# EAGLE design RaspiPower (EAGLE 7.7.0)
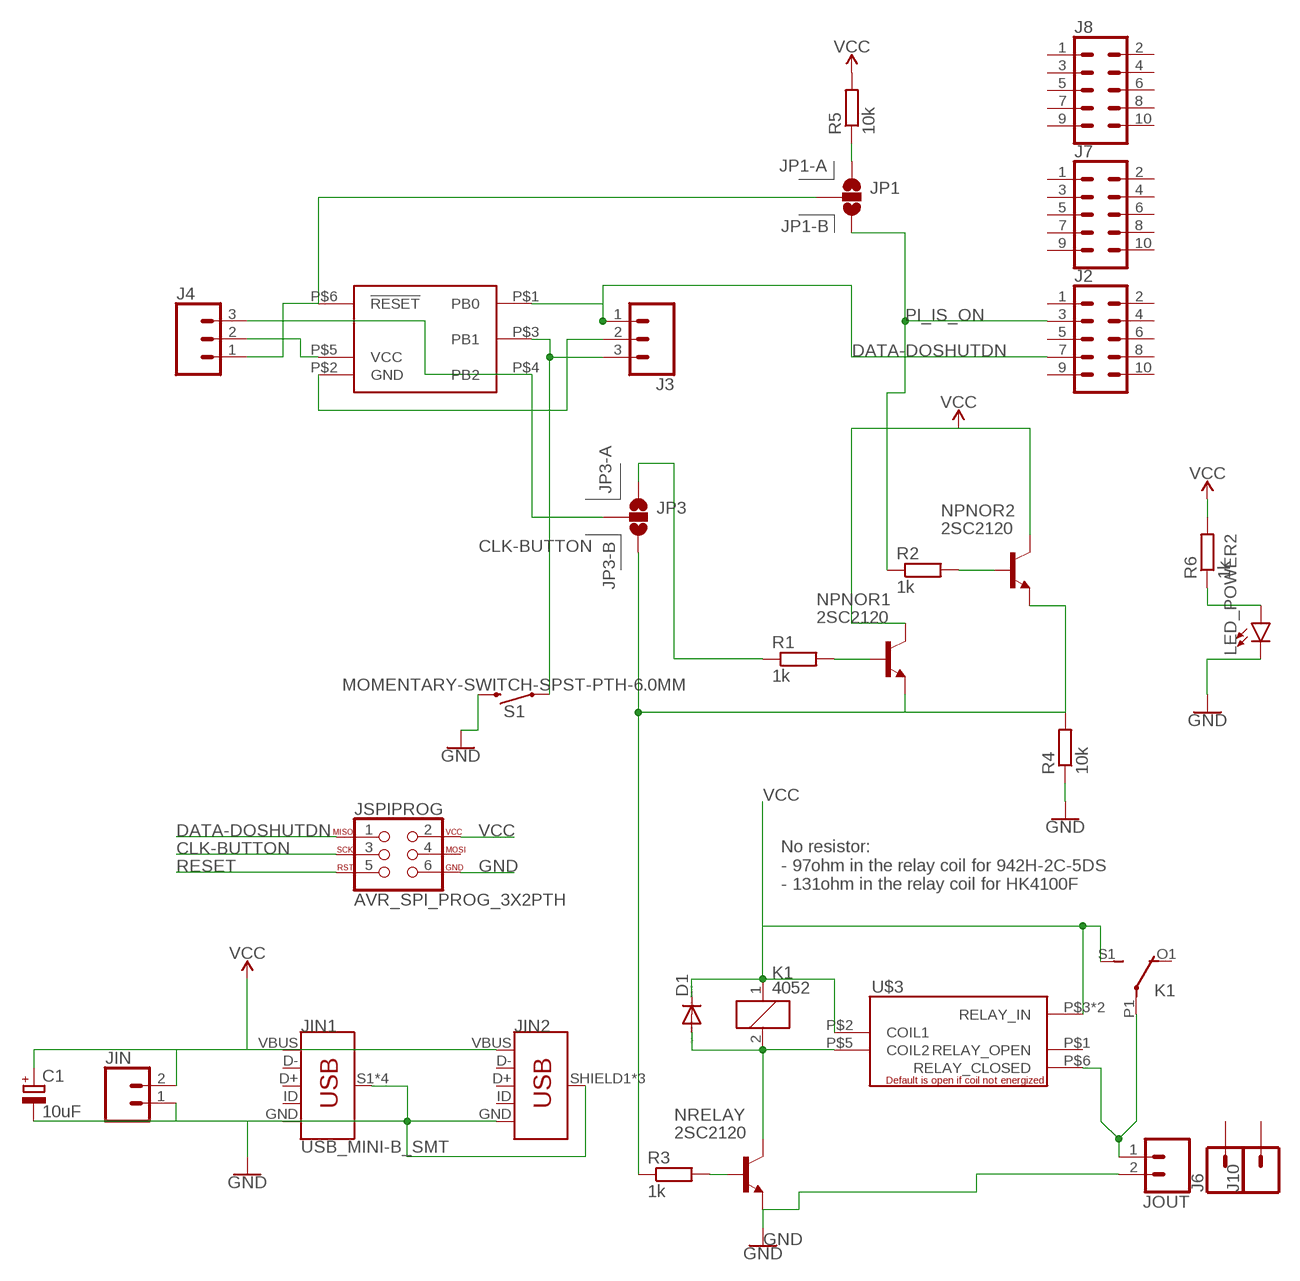
[diagram p0: schematic, sheet 1]

## Parts
C1  10uF  CPOL-EUE2.5-5  [E2,5-5]
D1  DIODE-D-5  [D-5]
J2  CONN_05X2PTH  [2X5]
J3  CONN_03  [1X03]
J4  CONN_03  [1X03]
J6  CONN_01PTH_NO_SILK_YES_STOP  [1X01_NO_SILK]
J7  CONN_05X2PTH  [2X5]
J8  CONN_05X2PTH  [2X5]
J10  CONN_01PTH_NO_SILK_YES_STOP  [1X01_NO_SILK]
JIN  CONN_02LOCK_LONGPADS  [1X02_LOCK_LONGPADS]
JIN1  USB_MINI-B_SMT  [USB-MINIB]
JIN2  USB_MICRO-B_FEMALE-SMT  [USB-B-MICRO-SMD]
JOUT  CONN_02LOCK_LONGPADS  [1X02_LOCK_LONGPADS]
JP1  JUMPER-SMT_3_NO_SILK  [SMT-JUMPER_3_NO_SILK]
JP3  JUMPER-SMT_3_NO_SILK  [SMT-JUMPER_3_NO_SILK]
JSPIPROG  AVR_SPI_PROG_3X2PTH  [2X3]
K1  4052  [F4052]
LED_POWER2  LED-FKIT-1206  [FKIT-LED-1206]
NPNOR1  2SC2120  -NPN-TO92-ECB  [TO92-ECB]
NPNOR2  2SC2120  -NPN-TO92-ECB  [TO92-ECB]
NRELAY  2SC2120  -NPN-TO92-ECB  [TO92-ECB]
R1  1k  R-EU_0207/2V  [0207/2V]
R2  1k  R-EU_0207/2V  [0207/2V]
R3  1k  R-EU_0204/7  [0204/7]
R4  10k  R-EU_0207/2V  [0207/2V]
R5  10k  R-EU_0207/2V  [0207/2V]
R6  1k  R-EU_R1206W  [R1206W]
S1  MOMENTARY-SWITCH-SPST-PTH-6.0MM  [TACTILE_SWITCH_PTH_6.0MM]
U$1  ATTINY10  [SOT23]
U$3  HK4100F  [HK4100F]

## Nets
CLK-BUTTON: J3.3 JSPIPROG.3 S1.1 U$1.P$3(PB1)
DATA-DOSHUTDN: J2.7 J3.1 JSPIPROG.1 U$1.P$1(PB0)
GND: C1.- J3.2 JIN1.GND JIN1.S1(SHIELD) JIN1.S2(SHIELD) JIN1.S3(SHIELD) JIN1.S4(SHIELD) JIN2.GND JIN2.SHIELD1(SHIELD) JIN2.SHIELD2(SHIELD) JIN2.SHIELD3(SHIELD) JIN.1 JOUT.2 JSPIPROG.6 LED_POWER2.C NRELAY.E R4.1 S1.3 U$1.P$2(GND)
N$1: LED_POWER2.A R6.1
N$4: JP3.3 NPNOR1.E NPNOR2.E R3.1 R4.2
N$5: J4.3 JP3.2 U$1.P$4(PB2)
N$7: JP1.1 R5.1
N$8: NRELAY.B R3.2
N$9: D1.A K1.2 NRELAY.C U$3.P$5(COIL2)
N$11: NPNOR1.B R1.2
N$12: NPNOR2.B R2.2
N$14: JP3.1 R1.1
PI_IS_ON: J2.3 JP1.3 R2.1
RESET: J4.1 JP1.2 JSPIPROG.5 U$1.P$6(!RESET)
VCC: C1.+ D1.C J4.2 JIN1.VBUS JIN2.VBUS JIN.2 JSPIPROG.2 K1.1 K1.S1(2:S) NPNOR1.C NPNOR2.C R5.2 R6.2 U$1.P$5(VCC) U$3.P$2(COIL1) U$3.P$3(RELAY_IN) U$3.P$4(RELAY_IN)
VOUT: JOUT.1 K1.P1(2:P) U$3.P$6(RELAY_CLOSED)
Unconnected: J2.1 J2.2 J2.4 J2.5 J2.6 J2.8 J2.9 J2.10 J6.1 J7.1 J7.2 J7.3 J7.4 J7.5 J7.6 J7.7 J7.8 J7.9 J7.10 J8.1 J8.2 J8.3 J8.4 J8.5 J8.6 J8.7 J8.8 J8.9 J8.10 J10.1 JIN1.D+ JIN1.D- JIN1.ID JIN2.D+ JIN2.D- JIN2.ID JSPIPROG.4 K1.O1(2:O) K1.O2(3:O) K1.P2(3:P) K1.S2(3:S) U$3.P$1(RELAY_OPEN)

## Notes on the sheet
- JP1-A
- JP1-B
- JP3-A
- JP3-B
- No resistor: 
  - 97ohm in the relay coil for 942H-2C-5DS
  - 131ohm in the relay coil for HK4100F

## Library data of the parts
C1 = resistor:CPOL-EU: POLARIZED CAPACITOR, European symbol
D1 = diode:DIODE-: DIODE
J2 J7 J8 = SparkFun-Connectors:CONN_05X2: Multi connection point. Often used as Generic Header-pin footprint for 0.1 inch spaced/style header connections For AVR SPI programming port, see special device with nice symbol: "AVR_SPI_PROG_5x2.dev" You can populate with any combo of single row headers, but if you'd like an exact match, check these: 2x5 AVR ICSP Male Header <https://www.sparkfun.com/products/778> (PRT-00778) 2x5 Pin Shrouded Header <https://www.sparkfun.com/products/8506> (PRT-08506) On any of the 0.1 inch spaced packages, you can populate with these: Break Away Headers - Straight <https://www.sparkfun.com/products/116> (PRT-00116) Break Away Male Headers - Right Angle <https://www.sparkfun.com/products/553> (PRT-00553) Female Headers <https://www.sparkfun.com/products/115> (PRT-00115) Break Away Headers - Machine Pin <https://www.sparkfun.com/products/117> (PRT-00117) Break Away Female Headers - Swiss Machine Pin <https://www.sparkfun.com/products/743> (PRT-00743) Special note: the shrouded connector mates well with our 5x2 ribbon cables: 2x5 Pin IDC Ribbon Cable <https://www.sparkfun.com/products/8535> (PRT-08535); PROD_ID: CONN-08499; SF_ID: PRT-0778
J3 J4 = SparkFun-Connectors:CONN_03: Multi connection point. Often used as Generic Header-pin footprint for 0.1 inch spaced/style header connections On any of the 0.1 inch spaced packages, you can populate with these: Break Away Headers - Straight <https://www.sparkfun.com/products/116> (PRT-00116) Break Away Male Headers - Right Angle <https://www.sparkfun.com/products/553> (PRT-00553) Female Headers <https://www.sparkfun.com/products/115> (PRT-00115) Break Away Headers - Machine Pin <https://www.sparkfun.com/products/117> (PRT-00117) Break Away Female Headers - Swiss Machine Pin <https://www.sparkfun.com/products/743> (PRT-00743) Stackable Header - 3 Pin (Female, 0.1") <https://www.sparkfun.com/products/13875> (PRT-13875) For SCREWTERMINALS and SPRING TERMINALS visit here: Screw Terimnals on SparkFun.com <https://www.sparkfun.com/search/results?term=Screw+Terminals> (5mm/3.5mm/2.54mm spacing) This device is also useful as a general connection point to wire up your design to another part of your project. Our various solder wires solder well into these plated through hole pads. Hook-Up Wire - Assortment (Stranded, 22 AWG) <https://www.sparkfun.com/products/11375> (PRT-11375) Hook-Up Wire - Assortment (Solid Core, 22 AWG) <https://www.sparkfun.com/products/11367> (PRT-11367) View the entire wire category on our website here <https://www.sparkfun.com/categories/141> Special notes: Molex polarized connector foot print use with SKU : PRT-08232 with associated crimp pins and housings.; PROD_ID: XXX-00000; VALUE: 455-1750-1-ND
J6 J10 = SparkFun-Connectors:CONN_01: Single connection point. Often used as Generic Header-pin footprint for 0.1 inch spaced/style header connections On any of the 0.1 inch spaced packages, you can populate with these: Break Away Headers - Straight <https://www.sparkfun.com/products/116> (PRT-00116) Break Away Male Headers - Right Angle <https://www.sparkfun.com/products/553> (PRT-00553) Female Headers <https://www.sparkfun.com/products/115> (PRT-00115) Break Away Headers - Machine Pin <https://www.sparkfun.com/products/117> (PRT-00117) Break Away Female Headers - Swiss Machine Pin <https://www.sparkfun.com/products/743> (PRT-00743) This device is also useful as a general connection point to wire up your design to another part of your project. Our various solder wires solder well into these plated through hole pads. Hook-Up Wire - Assortment (Stranded, 22 AWG) <https://www.sparkfun.com/products/11375> (PRT-11375) Hook-Up Wire - Assortment (Solid Core, 22 AWG) <https://www.sparkfun.com/products/11367> (PRT-11367) View the entire wire category on our website here <https://www.sparkfun.com/categories/141> Special notes: SMTSO-256-ET is a "flush mount" nut for a 4-40 screw. We mostly use this on specialty testbeds; it is a nice way to connect hardware to your PCB at an adjustable hieght. Also note, the SNAP packages are for using a snappable style connector. We sell a baggie of snaps and they are also used on two LilyPad designs: Snap Assortment - 30 pack (male and female) <https://www.sparkfun.com/products/11347> (DEV-11347) LilyPad Arduino SimpleSnap <https://www.sparkfun.com/products/10941> (DEV-10941) LilyPad SimpleSnap Protoboard <https://www.sparkfun.com/products/10940> (DEV-10940)
JIN JOUT = SparkFun-Connectors:CONN_02: Multi connection point. Often used as Generic Header-pin footprint for 0.1 inch spaced/style header connections On any of the 0.1 inch spaced packages, you can populate with these: Break Away Headers - Straight <https://www.sparkfun.com/products/116> (PRT-00116) Break Away Male Headers - Right Angle <https://www.sparkfun.com/products/553> (PRT-00553) Female Headers <https://www.sparkfun.com/products/115> (PRT-00115) Break Away Headers - Machine Pin <https://www.sparkfun.com/products/117> (PRT-00117) Break Away Female Headers - Swiss Machine Pin <https://www.sparkfun.com/products/743> (PRT-00743) For SCREWTERMINALS and SPRING TERMINALS visit here: Screw Terimnals on SparkFun.com <https://www.sparkfun.com/search/results?term=Screw+Terminals> (5mm/3.5mm/2.54mm spacing) This device is also useful as a general connection point to wire up your design to another part of your project. Our various solder wires solder well into these plated through hole pads. Hook-Up Wire - Assortment (Stranded, 22 AWG) <https://www.sparkfun.com/products/11375> (PRT-11375) Hook-Up Wire - Assortment (Solid Core, 22 AWG) <https://www.sparkfun.com/products/11367> (PRT-11367) View the entire wire category on our website here <https://www.sparkfun.com/categories/141> Special notes: Molex polarized connector foot print use with: PRT-08233 with associated crimp pins and housings. 2.54_SCREWTERM for use with PRT-10571. 3.5mm Screw Terminal footprints for PRT-08084 5mm Screw Terminal footprints for use with PRT-08432
JIN1 = SparkFun-Connectors:USB_MINI-B: USB type Mini-B Connector Breaks out 5th pin, and includes shield pins if needed. SparkFun Products: SparkFun FTDI Basic Breakout <https://www.sparkfun.com/products/9716> SparkFun XBee Explorer USB <https://www.sparkfun.com/products/11812> SparkFun Redboard <https://www.sparkfun.com/products/12757>; PROD_ID: CONN-08193; SF_ID: PRT-00587
JIN2 = SparkFun-Connectors:USB_MICRO-B: USB Type Micro-B Connector Male/female and PTH/SMT variants SparkFun Products: SparkFun microB USB Breakout <https://www.sparkfun.com/products/12035> SparkFun USB microB Plug Breakout <https://www.sparkfun.com/products/10031> SparkFun ESP8266 Thing <https://www.sparkfun.com/products/13231>; PROD_ID: CONN-11752
JP1 JP3 = SparkFun-Jumpers:JUMPER-SMT_3_NO: Normally open jumper This jumper has three pads in close proximity to each other. Apply solder to close the connection(s).
JSPIPROG = SparkFun-Connectors:AVR_SPI_PROG_3X2: AVR ISP 6 Pin This is the reduced ISP connector for AVR programming. Common on Arduino. This footprint will take up less PCB space and can be used with a 10-pin to 6-pin adapter such as SKU: BOB-08508 **Special note about "TEST_POINT" package. The stop mask is on the top side, so if you want your programming test points to be on the bottom of your board, make sure to place this package on the bottom side of the board. This also ensure that the orientation to program from the bottom side will be correct. SparkFun Products: SparkFun ISP Pogo Adapter <https://www.sparkfun.com/products/11591> - NS Tiny AVR Programmer <https://www.sparkfun.com/products/11801> -PTH
K1 = relay:4052: RELAY 2 x switch, Finder; OC_FARNELL: unknown; OC_NEWARK: unknown
LED_POWER2 = SparkFun-LED:LED: LED (Generic) Standard schematic elements and footprints for 5mm, 3mm, 1206, and 0603 sized LEDs. Generic LEDs with no color specified.
NPNOR1 NPNOR2 NRELAY = transistor:*-NPN-: NPN Transistror BF959 corrected 2008.03.06
R1-R6 = resistor:R-EU_: RESISTOR, European symbol
S1 = SparkFun-Switches:MOMENTARY-SWITCH-SPST: Momentary Switch (Pushbutton) - SPST Normally-open (NO) SPST momentary switches (buttons, pushbuttons). Variants PTH-12MM - 12mm square, through-hole Momentary Pushbutton Switch - 12mm Square <https://www.sparkfun.com/products/9190> (COM-09190) PTH-6.0MM, PTH-6.0MM-KIT - 6.0mm square, through-hole Mini Pushbutton Switch <https://www.sparkfun.com/products/97> (COM-00097) KIT package intended for soldering kit's - only one side of pads' copper is exposed. PTH-RIGHT-ANGLE-KIT - Right-angle, through-hole Right Angle Tactile Button <https://www.sparkfun.com/products/10791> - Used on SparkFun BigTime Watch Kit <https://www.sparkfun.com/products/11734> SMD-12MM - 12mm square, surface-mount Tactile Button - SMD (12mm) <https://www.sparkfun.com/products/12993> (COM-12993) Used on SparkFun PicoBoard <https://www.sparkfun.com/products/11888> SMD-4.5MM - 4.5mm Square Trackball Switch Used on SparkFun Blackberry Trackballer Breakout <https://www.sparkfun.com/products/13169> SMD-4.6MMX2.8MM - 4.60mm x 2.80mm, surface mount Used on SparkFun SAMD21 Mini Breakout <https://www.sparkfun.com/products/13664> SMD-5.2MM, SMD-5.2-REDUNDANT - 5.2mm square, surface-mount Mini Pushbutton Switch - SMD <https://www.sparkfun.com/products/8720> (COM-08720) Used on Arduino Pro Mini <https://www.sparkfun.com/products/11114> REDUNDANT package connects both switch circuits together SMD-6.0X3.5MM - 6.0 x 3.5mm, surface mount Momentary Reset Switch SMD <https://www.sparkfun.com/products/8229> (COM-08229) SMD-6.2MM-TALL - 6.2mm square, surface mount Tactile Button - SMD (6mm) <https://www.sparkfun.com/products/12992> Used on SparkFun Digital Sandbox <https://www.sparkfun.com/products/12651> SMD-RIGHT-ANGLE - Right-angle, surface mount Used on SparkFun Block for Intel® Edison - Arduino <https://www.sparkfun.com/products/13036>; PROD_ID: SWCH-08441; SF_SKU: COM-00097
U$1 = kalshagar:ATTINY10
U$3 = kalshagar:HK4100F: HK4100F-DC5V-SHG 5v relay

## Board
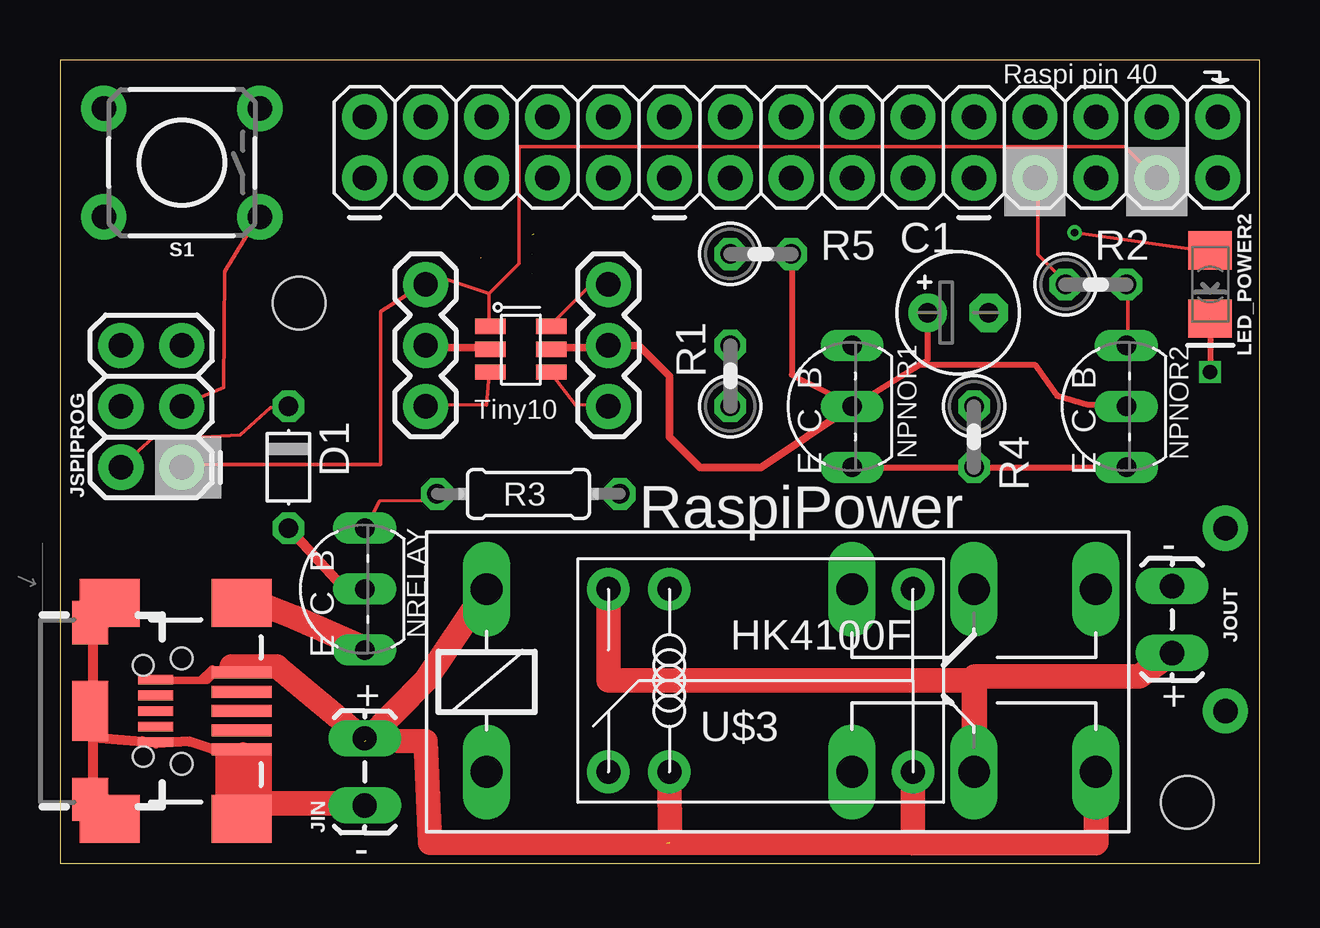
[diagram p1: board, top side]
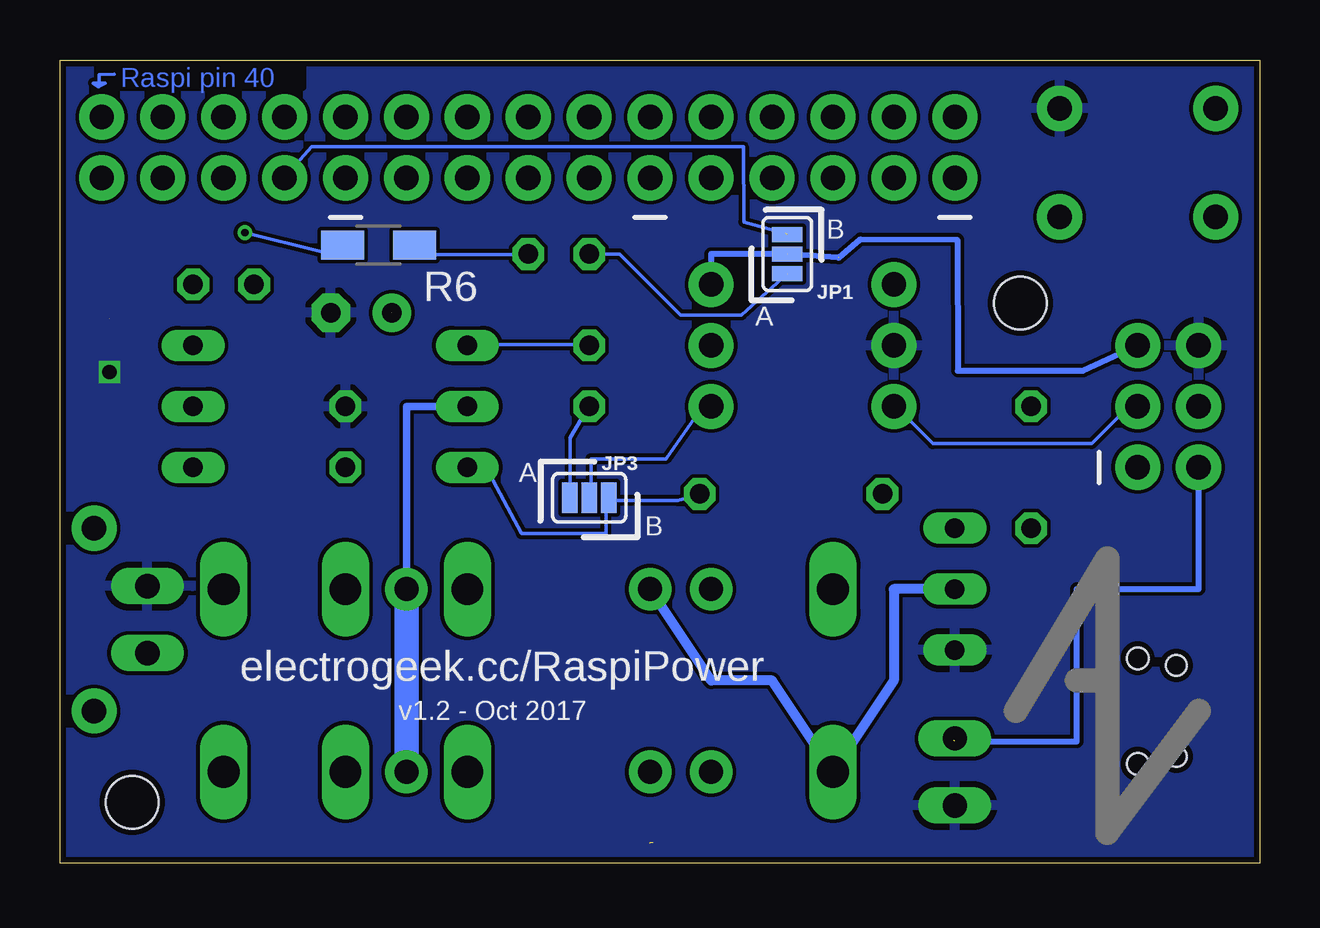
[diagram p2: board, bottom side, seen from below]

Size 50 x 33.49 mm. Coordinates in mm from the lower left corner, seen from the top.
Outline: 0,0 50,0 50,33.49 0,33.49 0,0
Copper layers (1*16): Top 0.035mm / dielectric 1.5mm / Bottom 0.035mm
Design rules "SeeedStudio_2layer_DRU_no_angle_20140221": minimum track width 6mil, minimum drill 12mil, track to track 6mil, track to pad 6mil, pad to pad 6mil, via to via 6mil, smd to smd 0mil, copper to edge 10mil, drill to drill 10mil, minimum pad ring 10mil, minimum via ring 6mil, stop-mask expansion 2mil, vias tented up to drill 100mil, thermal gap 10mil
Holes 2.2 mm at 9.97,23.35 46.99,2.54

### Footprints (pad centres in the part's own frame; a part is rotated, then mirrored left to right if it is on the bottom)
E2,5-5 = drill 0.813 pad 1.6: + -1.27,0 | drill 0.813 pad 1.6 octagon: - 1.27,0
D-5 = drill 0.813 octagon: A 2.54,0; C -2.54,0
2X5 = drill 1.016 pad 1.88: 1 0,0; 2 0,2.54; 3 2.54,0; 4 2.54,2.54; 5 5.08,0; 6 5.08,2.54; 7 7.62,0; 8 7.62,2.54; 9 10.16,0; 10 10.16,2.54
1X03 = drill 1.016 pad 1.88: 1 0,0; 2 2.54,0; 3 5.08,0
1X01_NO_SILK = drill 1.016 pad 1.88: 1 0,0
1X02_LOCK_LONGPADS = drill 1.016 long: 1 -0.127,0; 2 2.667,0
USB-MINIB = smd 2.5 x 0.5: D+ 2.5,0; D- 2.5,0.8; GND 2.5,-1.6; ID 2.5,-0.8; VBUS 2.5,1.6 | smd 2.5 x 2: S1 -3,4.5; S2 2.5,4.5; S3 -3,-4.5; S4 2.5,-4.5 | hole 0.9: 0,2.2; 0,-2.2
USB-B-MICRO-SMD = smd 1.45 x 0.4: D+ 2.725,0; D- 2.725,0.65; GND 2.725,-1.3; ID 2.725,-0.65; VBUS 2.725,1.3 | smd 1.5 x 1.8: SHIELD1 0,3.685; SHIELD2 0,-3.685 | smd 1.5 x 2.5: SHIELD3 0,0 | hole 0.85: 2.2,1.9; 2.2,-1.9
SMT-JUMPER_3_NO_SILK = smd 0.635 x 1.27: 1 -0.813,0; 2 0,0; 3 0.813,0
2X3 = drill 1.016 pad 1.88: 1 0,0; 2 0,2.54; 3 2.54,0; 4 2.54,2.54; 5 5.08,0; 6 5.08,2.54
F4052 = drill 1.321 long: 1 -3.81,3.81; 2 -3.81,-3.81; O1 11.43,-3.81; O2 11.43,3.81; P1 16.51,-3.81; P2 16.51,3.81; S1 21.59,-3.81; S2 21.59,3.81
FKIT-LED-1206 = smd 1.6 x 1.803: A -1.422,0; C 1.422,0
TO92-ECB = drill 0.813 long: B 2.54,0; C 0,0; E -2.54,0
0207/2V = drill 0.813 octagon: 1 -1.27,0; 2 1.27,0
0204/7 = drill 0.813 octagon: 1 -3.81,0; 2 3.81,0
R1206W = smd 1.8 x 1.2: 1 -1.499,0; 2 1.499,0
TACTILE_SWITCH_PTH_6.0MM = drill 1.016 pad 1.88: 1 -3.251,2.261; 2 3.251,2.261; 3 -3.251,-2.261; 4 3.251,-2.261
SOT23 = smd 0.635 x 1.27: P$1 0.476,-0.476; P$2 1.429,-0.476; P$3 2.381,-0.476; P$4 2.381,2.064; P$5 1.429,2.064; P$6 0.476,2.064
HK4100F = drill 1 pad 1.778: P$1 -3.81,-2.54; P$2 -1.27,-2.54; P$3 8.89,-2.54; P$4 8.89,5.08; P$5 -1.27,5.08; P$6 -3.81,5.08

### Placement (x,y rotation side)
C1  37.44,22.95 0 top
D1  9.53,16.51 270 top
J2  38.1,28.57 0 top
J3  15.24,24.13 270 top
J4  22.86,24.13 270 top
J6  48.58,6.35 0 top
J7  25.4,28.57 0 top
J8  12.7,28.57 0 top
J10  48.58,13.97 0 top
JIN  12.7,2.54 90 top
JIN1  5.08,6.35 0 top
JIN2  1.27,6.35 0 top
JOUT  46.35,8.89 90 top
JP1  19.68,25.4 90 bottom
JP3  27.94,15.24 0 bottom
JSPIPROG  5.08,16.51 90 top
K1  21.59,7.62 0 top
LED_POWER2  47.94,24.13 270 top
NPNOR1  33.02,19.05 90 top
NPNOR2  44.45,19.05 90 top
NRELAY  12.7,11.43 90 top
R1  27.94,20.32 90 top
R2  43.18,24.13 0 top
R3  19.53,15.4 180 top
R4  38.1,17.78 270 top
R5  29.21,25.4 0 top
R6  36.72,25.77 0 bottom
S1  5.08,29.21 180 top
U$1  18.41,22.86 270 top
U$3  26.67,6.35 0 top

### Tracks (layer width: path | path; a pad name or v marks a point on that pad's centre or on a via)
CLK-BUTTON
  Top 0.152: U$1.P$3 17.88,20.38 17.79,19.11 15.25,19.12 J3.3 | JSPIPROG.3 5.12,19.12 6.83,19.84 6.86,24.66 8.12,26.75 8.25,26.88 S1.1
  Bottom 0.152: J3.3 15.12,19 13.62,17.5 7,17.5 5.5,19 5.12,19 JSPIPROG.3
DATA-DOSHUTDN
  Top 0.152: 17.89,23.76 16,24.38 15.25,24.38 15.25,24.25 J3.1 15.12,24.12 13.37,23 13.37,16.62 5.12,16.62 JSPIPROG.1 | 17.89,23.76 17.88,22.5 U$1.P$1 | 17.89,23.76 19.12,25 19.12,29.88 44.38,29.88 45.62,28.62 J2.7
GND  (via drill 0.6)  (1 unrouted)
  Top 0.152: 7.5,4.68 7.5,4.75 JIN1.GND 7.62,4.75 | 4,5 JIN2.GND 3.88,5.12 3.43,5.09 | JIN1.S1 2,10.75 1.38,10.12 JIN2.SHIELD1 1.38,10 | JIN1.S3 2,1.88 2,2 1.38,2.62 JIN2.SHIELD2 1.38,2.75 | JIN2.SHIELD3 1.38,6.25 1.38,5.25 JIN2.SHIELD3 | 1.38,6.38 JIN2.SHIELD3 | 17.88,21.5 U$1.P$2 | 15.25,21.5 J3.2 | 47.88,22.62 LED_POWER2.C | 46.38,11.62 JOUT.2 | 7.62,10.75 JIN1.S2 | 12.62,9 NRELAY.E | 12.62,2.5 JIN.1 | 7.62,2.5 7.62,1.88 JIN1.S4 7.62,2.5
  Top 0.254: LED_POWER2.C v47.94,20.48
  Top 0.305: 15.25,21.5 17.88,21.5
  Top 0.406: 7.5,4.68 6.35,4.76 5.4,5.08 4,5 | 1.38,2.75 1.38,5.25 3.43,5.09 | 1.38,6.38 1.38,10 | 8.52,10.75 7.62,10.75
  Top 0.61: 7.62,4.75 7.62,2.5
  Top 1.016: 8.52,10.75 9.79,10.25 12.62,9 | 12.62,2.5 7.62,2.5
  pour Bottom: -1.27,34.29 50.8,34.29 50.8,-1.27 -1.27,-1.27
N$1  (via drill 0.3)
  Top 0.152: v42.29,26.29 47.88,25.5 LED_POWER2.A
  Bottom 0.152: v42.29,26.29 39.12,25.5 38.68,25.82 R6.1
N$2
  Bottom 0.152: 47.74,32.89 48.36,32.88 48.36,32.39 48.11,32.53 48.61,32.52 48.38,32.38
N$4
  Top 0.254: NPNOR1.E R4.2 NPNOR2.E
  Bottom 0.152: R3.1 24.25,15.12 27.12,15.12 JP3.3 27.25,15.12 27.25,13.75 30.77,13.75 32.25,16.5 33,16.5 NPNOR1.E
N$5
  Top 0.152: U$1.P$4 20.5,20.38 21.48,19.11 22.75,19.12 J4.3
  Bottom 0.152: JP3.2 27.88,15.25 27.88,16.86 24.75,16.86 23.25,19 22.88,19 J4.3
N$7  (1 unrouted)
  Bottom 0.152: JP1.1 21.59,22.86 24.13,22.86 26.67,25.4 R5.1
N$8
  Top 0.152: NRELAY.B 12.75,14 13.32,15.11 15.23,15.12 R3.2
N$9
  Top 0.152: 12.62,11.5 NRELAY.C | 9.62,13.88 D1.A
  Top 0.406: 12.62,11.5 11.53,11.82 9.62,13.88
  Bottom 0.406: NRELAY.C 15.24,11.43 15.24,7.62 K1.2 20.32,7.62 22.86,7.62 U$3.P$5
N$11
  Bottom 0.152: R1.2 28,21.62 33,21.62 NPNOR1.B
N$12
  Top 0.152: NPNOR2.B 44.5,21.62 44.5,24.12 R2.2
N$14
  Bottom 0.152: JP3.1 28.75,17.73 28,19 R1.1
PI_IS_ON  (1 unrouted)
  Top 0.152: R2.1 41.88,24.25 40.75,25.38 40.75,28.5 J2.3
  Bottom 0.152: 19.75,26.25 21.5,26.73 21.51,29.87 39.51,29.87 40.62,28.62 J2.3
RESET  (2 unrouted)
  Top 0.152: U$1.P$6 20.5,22.5 22.12,24.12 22.75,24.12 J4.1 | 5.12,21.62 JSPIPROG.5
  Bottom 0.254: 17.54,25.25 16.62,26.02 12.6,26 12.58,20.53 7.35,20.53 JSPIPROG.5 | 17.54,25.25 JP1.2 22.86,25.4 J4.1
VCC  (4 unrouted)
  Top 0.152: D1.C 9.5,19 8.79,19 7.52,17.86 5.5,17.75 3.9,17.75 2.62,16.62 JSPIPROG.2 2.62,16.5 | 6.38,7.88 7.5,7.88 JIN1.VBUS 7.62,8 7.15,8.21 | 4,7.62 JIN2.VBUS 5.84,7.62 | 12.76,5.12 12.62,5.25 JIN.2 12.75,5.12 | 17.75,11.38 K1.1 | 20.5,21.5 U$1.P$5 | 22.75,21.5 J4.2 | 33,19.12 NPNOR1.C 33.12,19.12 35.79,20.78 | 30.5,25.38 R5.2 | 44.38,19.12 NPNOR2.C
  Top 0.254: 33,19.12 30.5,20.36 30.5,25.38 | 44.38,19.12 42.83,19.12 41.56,19.5 40.63,20.78 35.79,20.78 | NPNOR1.C 36.17,21.01 36.17,22.96
  Top 0.305: 5.84,7.62 6.12,7.62 6.38,7.88 | 5.84,7.62 4,7.62 | 5.84,7.62 6.35,8.1 | 22.75,21.5 20.5,21.5 | NPNOR1.C 29.21,16.51 26.67,16.51 25.4,17.78 25.4,20.32 24.13,21.59 J4.2
  Top 0.406: 12.76,5.12 JIN.2
  Top 1.016: 7.15,8.21 9.02,8.21 12.76,5.12 15.24,7.62 17.75,11.38 | 12.75,5.12 15.24,5.08 15.42,0.86 25.29,0.86 | 25.42,0.86 43.19,0.86 K1.S1 43.17,0.83 35.55,0.83 U$3.P$3 | U$3.P$2 25.42,0.86
  Bottom 0.152: R6.2 35.38,25.74 35.38,25.38 30.5,25.38 R5.2
  Bottom 0.254: 12.7,5.08 7.62,5.08 7.62,11.43 2.54,11.43 JSPIPROG.2
  Bottom 0.305: U$3.P$4 35.56,19.05 NPNOR1.C
  Bottom 1.016: U$3.P$3 U$3.P$4
VOUT
  Top 0.152: 38.12,3.88 K1.P1
  Top 0.305: 38.12,7.8 38.12,7.99
  Top 1.016: 38.12,3.88 38.12,7.8 44.98,7.8 JOUT.1 | K1.P1 38.1,7.62 22.86,7.62 U$3.P$6
(copper drawn outside any net)
  shapes: Top area x1

### Text on the board
Bottom: Raspi pin 40
tPlace: Raspi pin 40 | Tiny10 | E C B | E C B | RaspiPower | - | E C B | + | + | -
bPlace: B | A | A | B | electrogeek.cc/RaspiPower | v1.2 - Oct 2017